# EAGLE design Syno_Ver1.4 (EAGLE 9.5.2)
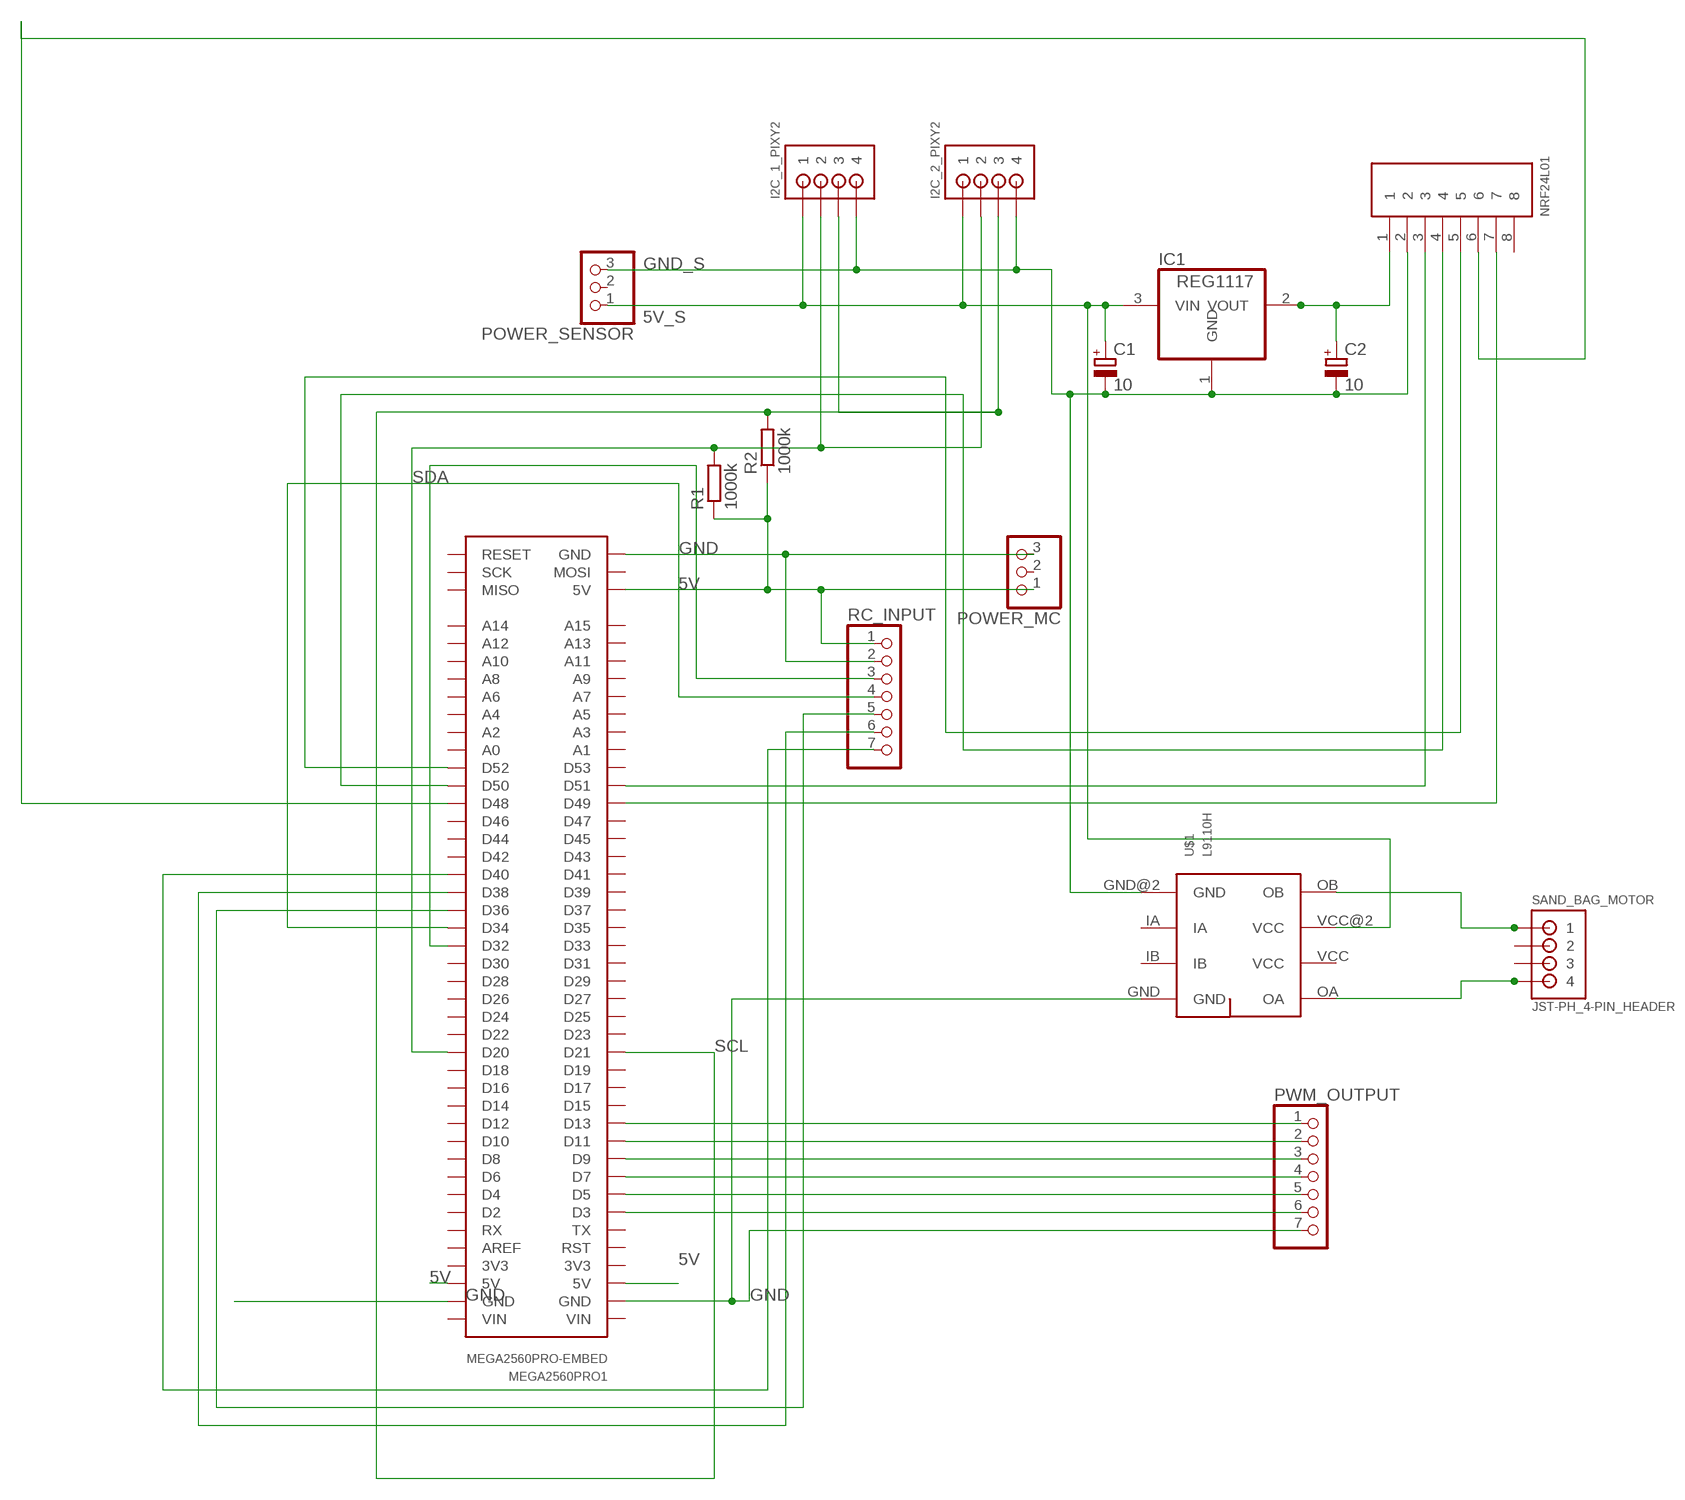
[diagram p0: schematic, sheet 1]

## Parts
C1  10  CPOL-EUE1.8-4  [E1,8-4]
C2  10  CPOL-EUE1.8-4  [E1,8-4]
I2C_1_PIXY2  JST-PH_4-PIN_HEADER  [JST_B4B-PH_HEADER]
I2C_2_PIXY2  JST-PH_4-PIN_HEADER  [JST_B4B-PH_HEADER]
IC1  REG1117  [SOT223]
MEGA2560PRO1  MEGA2560PRO-EMBED  [MEGA2560PRO-EMBED]
NRF24L01  8PIN  [B8B-PH-K-S]
POWER_MC  PINHD-1X3/90  [1X03/90]
POWER_SENSOR  PINHD-1X3/90  [1X03/90]
PWM_OUTPUT  PINHD-1X7/90  [1X07/90]
R1  1000k  R-EU_0204/5  [0204/5]
R2  1000k  R-EU_0204/5  [0204/5]
RC_INPUT  PINHD-1X7/90  [1X07/90]
SAND_BAG_MOTOR  JST-PH_4-PIN_HEADER  [JST_B4B-PH_HEADER]
U$1  L9110H  [L9110H]

## Nets
5V: MEGA2560PRO1.5V@1(5V) MEGA2560PRO1.5V@2(5V) MEGA2560PRO1.5V@3(5V) POWER_MC.1 R1.1 R2.1 RC_INPUT.1
5V_S: C1.+ I2C_1_PIXY2.P1 I2C_2_PIXY2.P1 IC1.3(VIN) POWER_SENSOR.1 U$1.VCC@2(VCC)
GND: MEGA2560PRO1.GND@1(GND) MEGA2560PRO1.GND@2(GND) MEGA2560PRO1.GND@3(GND) POWER_MC.3 PWM_OUTPUT.7 RC_INPUT.2 U$1.GND
GND_S: C1.- C2.- I2C_1_PIXY2.P4 I2C_2_PIXY2.P4 IC1.1(GND) NRF24L01.2 POWER_SENSOR.3 U$1.GND@2(GND)
N$1: MEGA2560PRO1.D51 NRF24L01.3
N$2: C2.+ IC1.2(VOUT) NRF24L01.1
N$3: MEGA2560PRO1.D50 NRF24L01.4
N$4: MEGA2560PRO1.D52 NRF24L01.5
N$5: SAND_BAG_MOTOR.P1 U$1.OB
N$6: SAND_BAG_MOTOR.P4 U$1.OA
N$7: MEGA2560PRO1.D13 PWM_OUTPUT.1
N$8: MEGA2560PRO1.D11 PWM_OUTPUT.2
N$9: MEGA2560PRO1.D9 PWM_OUTPUT.3
N$10: MEGA2560PRO1.D7 PWM_OUTPUT.4
N$11: MEGA2560PRO1.D5 PWM_OUTPUT.5
N$12: MEGA2560PRO1.D3 PWM_OUTPUT.6
N$13: MEGA2560PRO1.D32 RC_INPUT.3
N$14: MEGA2560PRO1.D34 RC_INPUT.4
N$15: MEGA2560PRO1.D36 RC_INPUT.5
N$16: MEGA2560PRO1.D38 RC_INPUT.6
N$17: MEGA2560PRO1.D40 RC_INPUT.7
N$18: MEGA2560PRO1.D48 NRF24L01.6
N$19: MEGA2560PRO1.D49 NRF24L01.7
SCL: I2C_1_PIXY2.P3 I2C_2_PIXY2.P3 MEGA2560PRO1.D21 R2.2
SDA: I2C_1_PIXY2.P2 I2C_2_PIXY2.P2 MEGA2560PRO1.D20 R1.2
Unconnected: MEGA2560PRO1.3V3@1(3V3) MEGA2560PRO1.3V3@2(3V3) MEGA2560PRO1.A0 MEGA2560PRO1.A1 MEGA2560PRO1.A2 MEGA2560PRO1.A3 MEGA2560PRO1.A4 MEGA2560PRO1.A5 MEGA2560PRO1.A6 MEGA2560PRO1.A7 MEGA2560PRO1.A8 MEGA2560PRO1.A9 MEGA2560PRO1.A10 MEGA2560PRO1.A11 MEGA2560PRO1.A12 MEGA2560PRO1.A13 MEGA2560PRO1.A14 MEGA2560PRO1.A15 MEGA2560PRO1.AREF MEGA2560PRO1.D2 MEGA2560PRO1.D4 MEGA2560PRO1.D6 MEGA2560PRO1.D8 MEGA2560PRO1.D10 MEGA2560PRO1.D12 MEGA2560PRO1.D14 MEGA2560PRO1.D15 MEGA2560PRO1.D16 MEGA2560PRO1.D17 MEGA2560PRO1.D18 MEGA2560PRO1.D19 MEGA2560PRO1.D22 MEGA2560PRO1.D23 MEGA2560PRO1.D24 MEGA2560PRO1.D25 MEGA2560PRO1.D26 MEGA2560PRO1.D27 MEGA2560PRO1.D28 MEGA2560PRO1.D29 MEGA2560PRO1.D30 MEGA2560PRO1.D31 MEGA2560PRO1.D33 MEGA2560PRO1.D35 MEGA2560PRO1.D37 MEGA2560PRO1.D39 MEGA2560PRO1.D41 MEGA2560PRO1.D42 MEGA2560PRO1.D43 MEGA2560PRO1.D44 MEGA2560PRO1.D45 MEGA2560PRO1.D46 MEGA2560PRO1.D47 MEGA2560PRO1.D53 MEGA2560PRO1.MISO MEGA2560PRO1.MOSI MEGA2560PRO1.RESET MEGA2560PRO1.RST MEGA2560PRO1.RX MEGA2560PRO1.SCK MEGA2560PRO1.TX MEGA2560PRO1.VIN@1(VIN) MEGA2560PRO1.VIN@2(VIN) NRF24L01.8 POWER_MC.2 POWER_SENSOR.2 SAND_BAG_MOTOR.P2 SAND_BAG_MOTOR.P3 U$1.IA U$1.IB

## Power pins joined to a net without a drawn wire
VCC: U$1.VCC

## Library data of the parts
C1 C2 = rcl:CPOL-EU: POLARIZED CAPACITOR, European symbol; SPICEPREFIX: C
I2C_1_PIXY2 I2C_2_PIXY2 SAND_BAG_MOTOR = srg:JST-PH_4-PIN_HEADER: 4-pin JST PH Shrouded Header, top entry P/N B4B-PH-K-S Mating connector PHR-4 Mating cable assembly: Sparkfun PRT-09916 <http://www.sparkfun.com/products/9916>
IC1 = burr-brown:REG1117: 800mA and 1A Low Dropout (LDO) Positive Regulator 1.8V, 2.5V, 2.85V, 3.3V, 5V, and Adj; MPN: REG1117; OC_FARNELL: 1097566; OC_NEWARK: 14P6981
MEGA2560PRO1 = robotdyn:MEGA2560PRO-EMBED: Robotdyn Robotdyn Mega 2560 PRO (Embed) https://robotdyn.com/mega-2560-pro-embed-ch340g-atmega2560-16au.html
NRF24L01 = jst_eph:8PIN
POWER_MC POWER_SENSOR = pinhead:PINHD-1X3: PIN HEADER
PWM_OUTPUT RC_INPUT = pinhead:PINHD-1X7: PIN HEADER
R1 R2 = rcl:R-EU_: RESISTOR, European symbol; SPICEPREFIX: R
U$1 = L9110:L9110H: H bridge ic

## Board
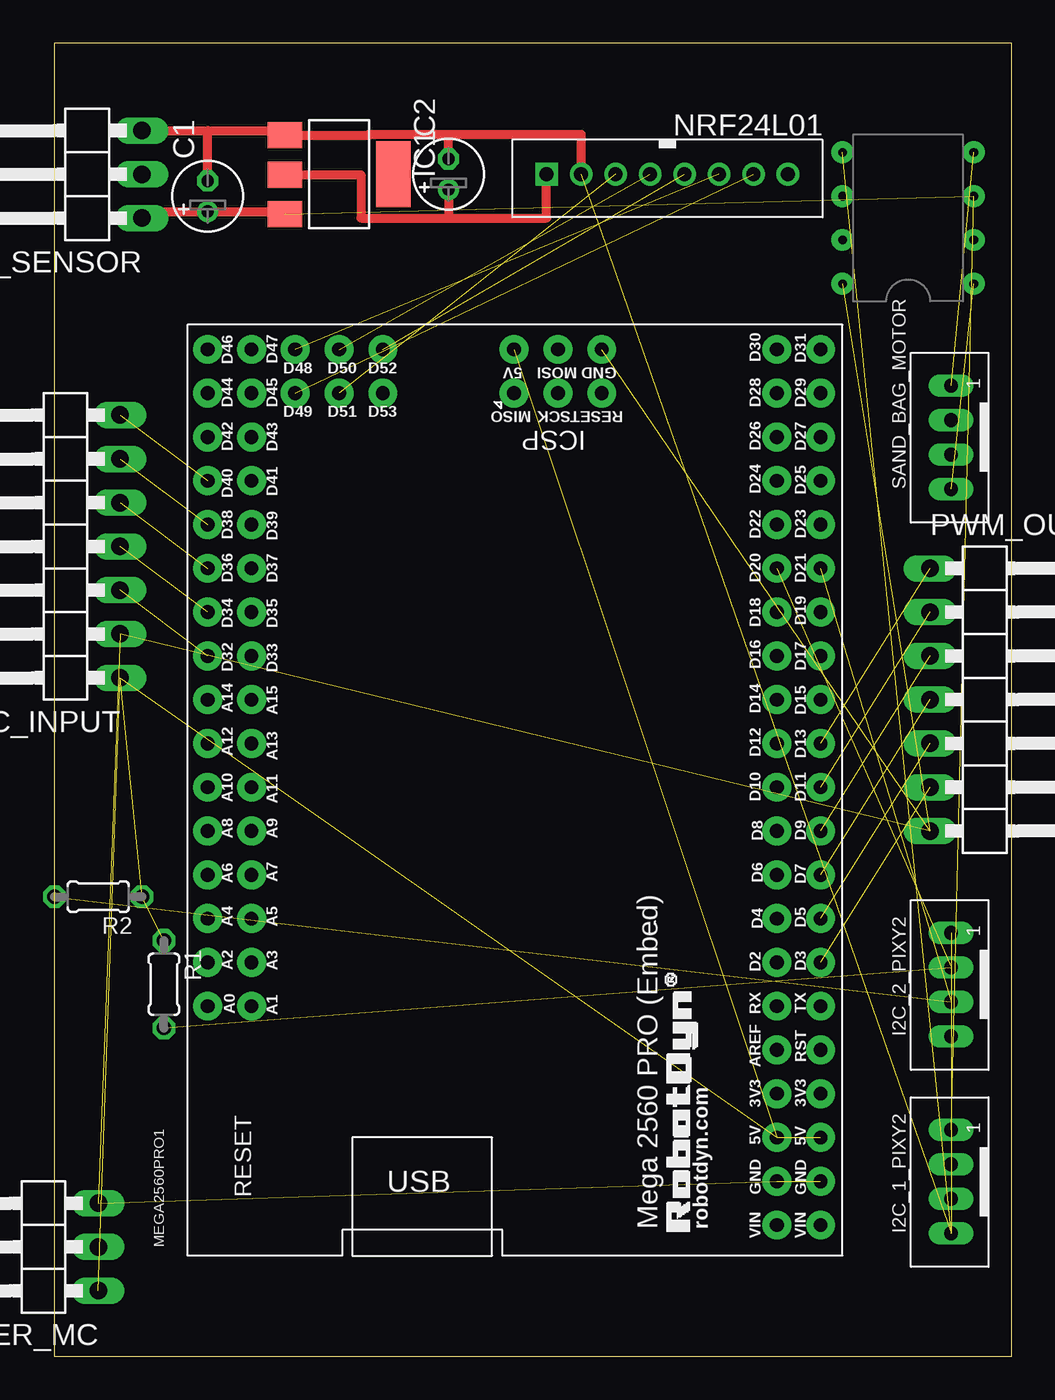
[diagram p1: board, top side]

Size 55.55 x 76.19 mm. Coordinates in mm from the lower left corner, seen from the top.
Outline: 0,0 55.55,0 55.55,76.19 0,76.19 0,0
Copper layers (1*16): Top 0.035mm / dielectric 1.5mm / Bottom 0.035mm
Design rules "default": minimum track width 6mil, minimum drill 0.35mm, track to track 6mil, track to pad 6mil, pad to pad 6mil, via to via 6mil, smd to smd 6mil, copper to edge 40mil, drill to drill 6mil, minimum pad ring 10mil, minimum via ring 8mil, stop-mask expansion 4mil, vias tented up to drill 0mil, thermal gap 10mil

### Footprints (pad centres in the part's own frame; a part is rotated, then mirrored left to right if it is on the bottom)
E1,8-4 = drill 0.711 pad 1.168: + -0.889,0 | drill 0.711 pad 1.168 octagon: - 0.889,0
JST_B4B-PH_HEADER = drill 0.8 long: P1 2.98,0.048; P2 0.98,0.048; P3 -1.02,0.048; P4 -3.02,0.048
SOT223 = smd 1.499 x 2.007: 1 -2.261,-3.15; 2 0.025,-3.15; 3 2.311,-3.15 | smd 3.81 x 2.007: 4 0,3.15
MEGA2560PRO-EMBED = drill 0.8 pad 1.676: 3V3@1 -25.4,-19.05; 3V3@2 -25.4,-16.51; 5V@1 -27.94,-19.05; 5V@2 -27.94,-16.51; 5V@3 17.78,-1.27; A0 -20.32,16.51; A1 -20.32,13.97; A2 -17.78,16.51; A3 -17.78,13.97; A4 -15.24,16.51; A5 -15.24,13.97; A6 -12.7,16.51; A7 -12.7,13.97; A8 -10.16,16.51; A9 -10.16,13.97; A10 -7.62,16.51; A11 -7.62,13.97; A12 -5.08,16.51; A13 -5.08,13.97; A14 -2.54,16.51; A15 -2.54,13.97; AREF -22.86,-16.51; D2 -17.78,-16.51; D3 -17.78,-19.05; D4 -15.24,-16.51; D5 -15.24,-19.05; D6 -12.7,-16.51; D7 -12.7,-19.05; D8 -10.16,-16.51; D9 -10.16,-19.05; D10 -7.62,-16.51; D11 -7.62,-19.05; D12 -5.08,-16.51; D13 -5.08,-19.05; D14 -2.54,-16.51; D15 -2.54,-19.05; D16 0,-16.51; D17 0,-19.05; D18 2.54,-16.51; D19 2.54,-19.05; D20 5.08,-16.51; D21 5.08,-19.05; D22 7.62,-16.51; D23 7.62,-19.05; D24 10.16,-16.51; D25 10.16,-19.05; D26 12.7,-16.51; D27 12.7,-19.05; D28 15.24,-16.51; D29 15.24,-19.05; D30 17.78,-16.51; D31 17.78,-19.05; D32 0,16.51; D33 0,13.97; D34 2.54,16.51; D35 2.54,13.97; D36 5.08,16.51; D37 5.08,13.97; D38 7.62,16.51; D39 7.62,13.97; D40 10.16,16.51; D41 10.16,13.97; D42 12.7,16.51; D43 12.7,13.97; D44 15.24,16.51; D45 15.24,13.97; D46 17.78,16.51; D47 17.78,13.97; D48 17.78,11.43; D49 15.24,11.43; D50 17.78,8.89; D51 15.24,8.89; D52 17.78,6.35; D53 15.24,6.35; GND@1 -30.48,-19.05; GND@2 -30.48,-16.51; GND@3 17.78,-6.35; MISO 15.24,-1.27; MOSI 17.78,-3.81; RESET 15.24,-6.35; RST -22.86,-19.05; RX -20.32,-16.51; SCK 15.24,-3.81; TX -20.32,-19.05; VIN@1 -33.02,-19.05; VIN@2 -33.02,-16.51
B8B-PH-K-S = drill 0.813 square: 1 7,0 | drill 0.813: 2 5,0; 3 3,0; 4 1,0; 5 -1,0; 6 -3,0; 7 -5,0; 8 -7,0
1X03/90 = drill 1.016 long: 1 -2.54,-3.81; 2 0,-3.81; 3 2.54,-3.81
1X07/90 = drill 1.016 long: 1 -7.62,-3.81; 2 -5.08,-3.81; 3 -2.54,-3.81; 4 0,-3.81; 5 2.54,-3.81; 6 5.08,-3.81; 7 7.62,-3.81
0204/5 = drill 0.813 octagon: 1 -2.54,0; 2 2.54,0
L9110H = drill 0.5 pad 1.27: GND 7.62,7.62; GND@2 7.62,0; IA 7.62,2.54; IB 7.62,5.08; OA 0,7.62; OB 0,0; VCC 0,5.08; VCC@2 0,2.54

### Placement (x,y rotation side)
C1  8.89,67.31 90 top
C2  22.86,68.58 90 top
I2C_1_PIXY2  52.07,10.16 90 top
I2C_2_PIXY2  52.07,21.59 90 top
IC1  16.51,68.58 270 top
MEGA2560PRO1  25.4,40.64 90 top
NRF24L01  35.56,68.58 180 top
POWER_MC  -1.27,6.35 90 top
POWER_SENSOR  1.27,68.58 90 top
PWM_OUTPUT  54.61,38.1 270 top
R1  6.35,21.59 270 top
R2  2.54,26.67 180 top
RC_INPUT  0,46.99 90 top
SAND_BAG_MOTOR  52.07,53.34 90 top
U$1  53.34,69.85 180 top

### Tracks (layer width: path | path; a pad name or v marks a point on that pad's centre or on a via)
5V  (6 unrouted)
5V_S  (3 unrouted)
  Top 0.508: POWER_SENSOR.1 5.46,66.42 C1.+ 13.21,66.42 IC1.3
GND  (6 unrouted)
GND_S  (3 unrouted)
  Top 0.508: POWER_SENSOR.3 8.89,71.12 | 8.89,71.12 13.08,71.12 IC1.1 18.25,70.84 18.25,70.89 22.86,70.89 | C1.- 8.89,71.12 | C2.- 22.86,70.89 | 22.86,70.89 30.56,70.89 NRF24L01.2
N$1  (1 unrouted)
N$2
  Top 0.508: IC1.2 17.78,68.56 17.78,66.04 22.86,66.04 | C2.+ 22.86,66.04 | 22.86,66.04 28.56,66.04 NRF24L01.1
N$3  (1 unrouted)
N$4  (1 unrouted)
N$5  (1 unrouted)
N$6  (1 unrouted)
N$7  (1 unrouted)
N$8  (1 unrouted)
N$9  (1 unrouted)
N$10  (1 unrouted)
N$11  (1 unrouted)
N$12  (1 unrouted)
N$13  (1 unrouted)
N$14  (1 unrouted)
N$15  (1 unrouted)
N$16  (1 unrouted)
N$17  (1 unrouted)
N$18  (1 unrouted)
N$19  (1 unrouted)
SCL  (3 unrouted)
SDA  (3 unrouted)